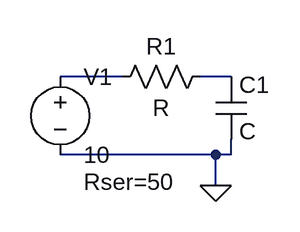
[diagram p0: schematic simulacion del filtro pasabajos.asc]
simulacion del filtro pasabajos.asc, the LTspice schematic file:
Version 4
SHEET 1 880 680
WIRE 64 128 0 128
WIRE 176 128 144 128
WIRE 160 208 0 208
WIRE 176 208 176 192
WIRE 176 208 160 208
WIRE 160 240 160 208
FLAG 160 240 0
SYMBOL cap 160 128 R0
SYMATTR InstName C1
SYMBOL res 160 112 R90
WINDOW 0 0 56 VBottom 2
WINDOW 3 32 56 VTop 2
SYMATTR InstName R1
SYMBOL voltage 0 112 R0
WINDOW 123 0 0 Left 2
WINDOW 39 24 124 Left 2
SYMATTR InstName V1
SYMATTR Value 10
SYMATTR SpiceLine Rser=50

The netlist it stands for:
* simulacion del filtro pasabajos.asc
C1 N002 0 C
R1 N002 N001 R
V1 N001 0 10 Rser=50
.backanno
.end